# Altium project ECU.PrjPcb (part 2 of 2)

## Sheet CAN.SchDoc
size 420 x 297 mm; SheetNumber: 8; SheetTotal: 11
Used 2 times, as channels CAN 1, CAN 2. Parts and nets are listed once, with the designators drawn on the sheet.
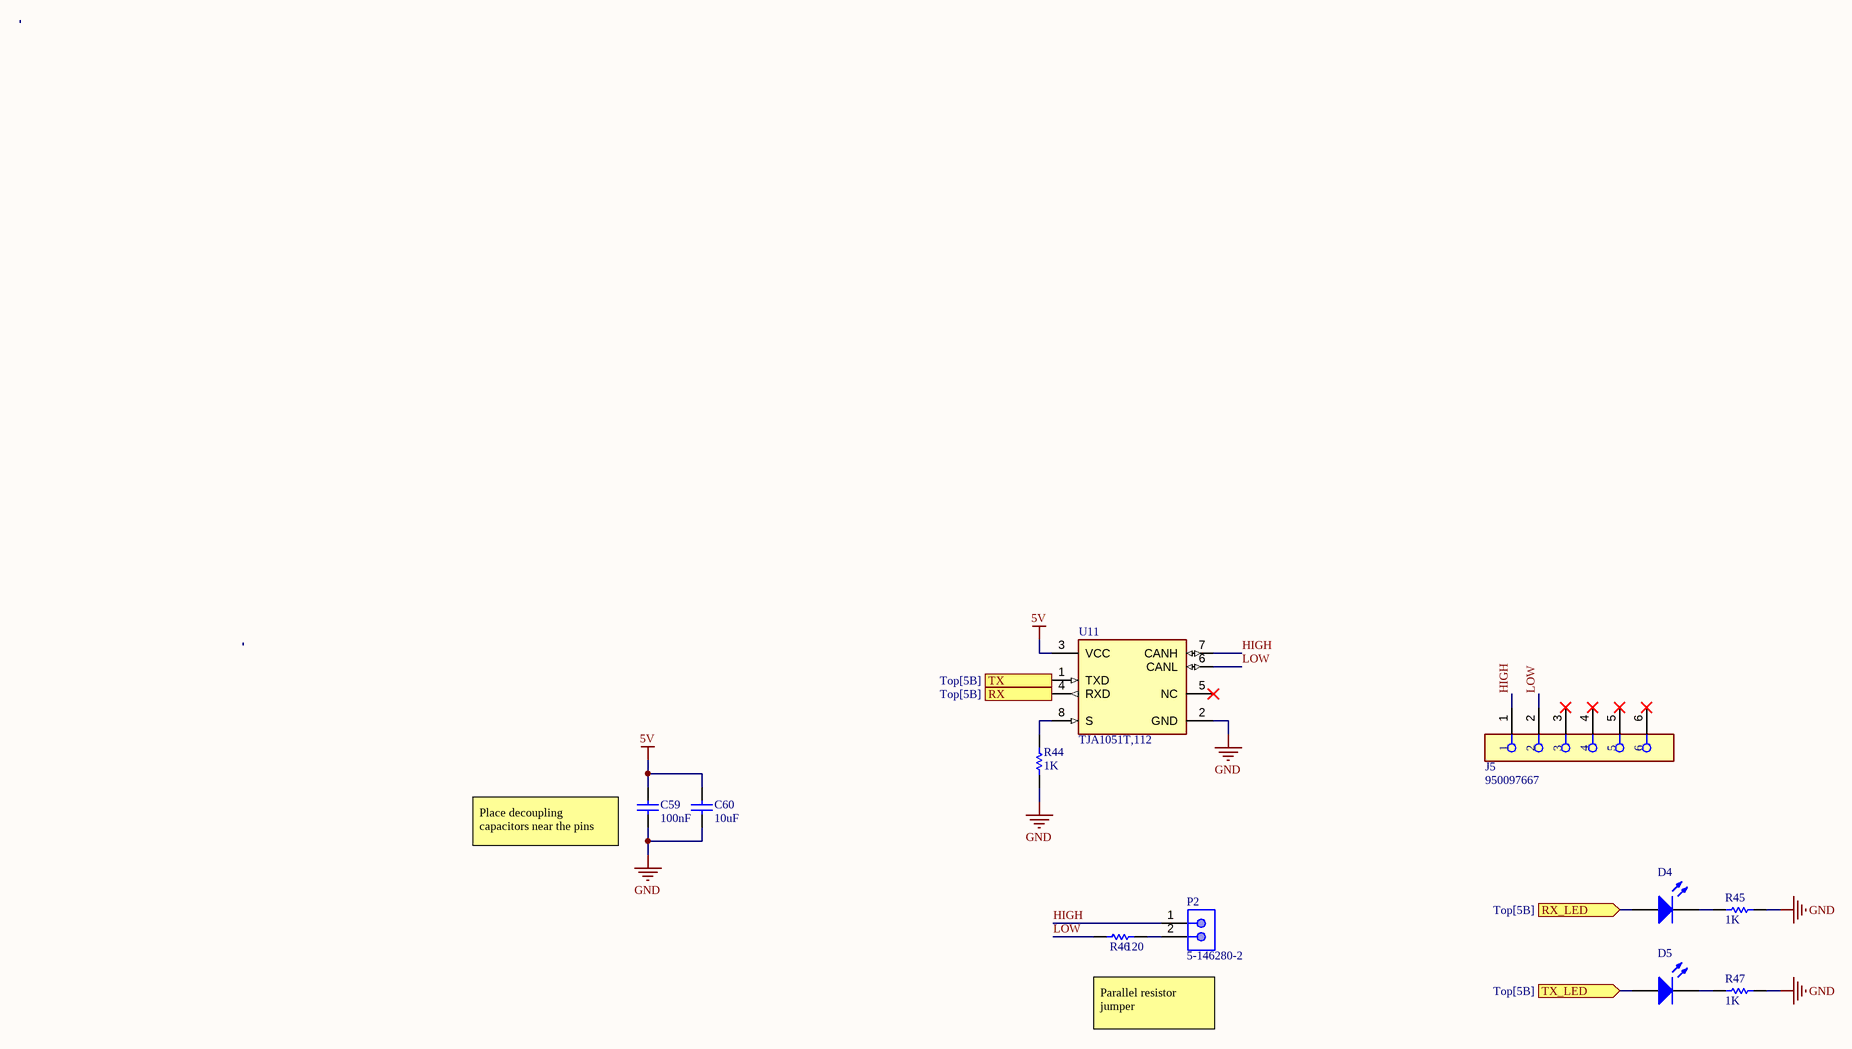
[diagram p8: CAN.SchDoc]

### Parts
C59  value 100nF  (hidden comment: Capacitor)
C60  value 10uF  (hidden comment: Capacitor)
D4  Light-Emitting Diode  (value not drawn)
D5  Light-Emitting Diode  (value not drawn)
J5  950097667  [FP-950097667-MFG]
P2  5-146280-2  [TECO-5-146280-2_V]
R44  value 1K  (hidden comment: Resistor)
R45  value 1K  (hidden comment: Resistor)
R46  value 120  (hidden comment: Resistor)
R47  value 1K  (hidden comment: Resistor)
U11  TJA1051T,112  [FP-SOT96-1-MFG]

### Ports
RX (out, see Top[5B]), RX_LED (in, see Top[5B]), TX (in, see Top[5B]), TX_LED (in, see Top[5B])

### Nets
5V: C59.2 C60.2 U11.3(VCC)
GND: C59.1 C60.1 R44.1 R45.2 R47.2 U11.2(GND)
HIGH: J5.1 P2.1 U11.7(CANH)
LOW: J5.2 R46.1 U11.6(CANL)
RX: U11.4(RXD) ; port RX
RX_LED: D4.1(A) ; port RX_LED
TX: U11.1(TXD) ; port TX
TX_LED: D5.1(A) ; port TX_LED
NetD4_2: D4.2(K) R45.1
NetD5_2: D5.2(K) R47.1
NetP2_2: P2.2 R46.2
NetR44_2: R44.2 U11.8(S)

Not connected (* = marked no-connect by the designer): J5 3* 4* 5* 6*; U11 5(NC)*

### Channels
CAN 1: designators end in _CAN_1; ports RX=NetU11_CAN_1_4 RX_LED=NetD4_CAN_1_1 TX=NetU11_CAN_1_1 TX_LED=NetD5_CAN_1_1
CAN 2: designators end in _CAN_2; ports RX=NetU11_CAN_2_4 RX_LED=NetD4_CAN_2_1 TX=NetU11_CAN_2_1 TX_LED=NetD5_CAN_2_1

### Notes on the sheet
- (near C59) Place decoupling capacitors near the pins
- Parallel resistor jumper
- THIS DOCUMENT AND THE DATA DISCLOSED HEREIN OR
- HEREWITH IS THE PROPERTY OF ALTIUM LIMITED AND MAY
- DWG NO:
- REVISION
- REV:
- DESCRIPTION
- DATE
- APPROVED
- BE FREELY DISTRIBUTED IN WHOLE. NO RIGHTS ARE
- RESERVED OR EXPRESS OR IMPLIED WARANTEE GIVEN.
- ENG:
- APPROVALS
- PROJECT
- DSN:
- CHK:
- REFERENCE DOCUMENTS
- PROJECT REVISION:
- TITLE
- DOCUMENT REVISION:
- DESIGN ITEM:
- BOM:
- FAB DWG:
- PCB DWG:
- ASSY DWG:
- SCALE:
- A3
- SIZE
- CAGE CODE
- FILE NAME
- DWG NO.
- SHEET
- OF
- REV

### Library data of the parts
C59 C60 = Capacitor: SimulationGenericComponent: True; Supplier 1: Arrow Electronics
D4 D5 = LED: AF: 1; BV: 0; BV_MAX: 1e99; EG: 1.11; FC: 0.5; IBV: 0.001; IS: 1e-14; MJSW: 0.33; NTUN: 30; TNOM: 27; XTI: 3; SimulationGenericComponent: True; CJO: 0; CJP: 0; CTA: 0; CTP: 0; FCS: 0.5; FV_MAX: 1e99; IKF: 0; IKR: 0; ISR: 1e-14; JSW: 0; JTUN: 0; JTUNSW: 0; KEG: 1; KF: 0; LEVEL: 1; N: 1; NBV: 1; NR: 1; NS: 1; PHP: 1; RS: 0; TCV: 0; TLEV: 0; TLEVC: 0; TM1: 0; TM2: 0; TPB: 0; TPHP: 0; TRS: 0; TRS2: 0; TT: 0; TTT1: 0; TTT2: 0; VJ: 1; XTITUN: 3
J5 = CMP-04778-000001-1: CONN MOD JACK 6P6C R/A UNSHLD; Manufacturer: Molex; Conn Gender: Female; Number Of Contacts: 6; Voltage Rating: 125V; Conn Orientation: Right Angle; Current Rating: 1.5A; Is Female: yes; Pitch: 1.27mm; Temperature Range Low: -40°C; Device Class L2: Modular / Ethernet Connectors; ComponentLink2URL: https://www.molex.com/webdocs/datasheets/pdf/en-us/0950097667_MODULAR_JACKS_PLUG.pdf; Temperature Range High: +80°C; Contact Material: Gold,Nickel; Automotive: No; Digikey Description: CONN MOD JACK 6P6C R/A UNSHLD; Octopart: https://octopart.com/95009-7667-molex-24622630; Device Class L1: Connectors; RoHS: TRUE; Category: Conn; Package: 950097667; Manufacturer Part Number: 950097667; ComponentLink2Description: Datasheet; Device Class L3: unset; Mouser Description: Modular Connectors / Ethernet Connectors STD JACK RA 6/6 NO RIB; Height: 16.25mm; Footprint Url: https://www.molex.com/pdm_docs/sd/950097667_sd.pdf; Temperature: -40°C to +80°C; Lead Free: Yes
P2 = CMP-2000-07492-1: Male Header, Pitch 2.54 mm, 1 x 2 Position, Height 8.21 mm, Tail Length 3.05 mm, -65 to 105 degC, RoHS, Bulk; Manufacturer: TE Connectivity; Mating Connector Lock: No(Without); Number of Positions: 2; Pitch: 2.54mm; PCB Mounting Orientation: Vertical; Keyed: No; Case\/Package: 100; Mating Post Length: 0.23inch; High Temperature Housing: Yes; Max Current Rating: 5A; PCB Thickness: 0.063inch; PCB Mount Retention: Without; Approvals: CSA; Current Rating: 3A; Radiation Hardening: No; Length: 4.67mm; Contact Mating Length: 0.23inch; Connector Type: Header; Number of Rows: 1; Termination Post Length: 0.12inch; Board Standoff: No(Without); Max Operating Temperature: 105degC; Contact Shape: Square; Selectively Loaded: No(Without); Gasket: No(Without); Number of Contacts: 2; Contact Gender: Male; Mating Alignment: No(Without); Manufacturer URL: http://www.te.com/; Datasheet URL: http://www.te.com/commerce/DocumentDelivery/DDEController?Action=showdoc&DocId=Customer+Drawing%7F146280%7FH1%7Fpdf%7FEnglish%7FENG_CD_146280_H1.pdf%7F5-146280-2; Mount: ThroughHole; Orientation: Straight; Packaging: Carton; Package Reference: 5-146280-2; Package Quantity: 500; Stabilizers: No(Without); Row Spacing: 2.54mm; Contact Material: CopperAlloy; Panel Mount Retention: No(Without); Datasheet Version: Rev. H1, 08/2016; Housing Colour: Black; Colour: Black; Package Description: Male Header, Pitch 2.54 mm, 1 x 2 Position, Height 8.21 mm, Tail Length 3.05 mm; Contact Plating: Matte; Housing Material: Polymer; Contact Protection: No(Without); Min Operating Temperature: -65degC; Mounting Technology: ThroughHole; Flammability Rating: UL94V-0; RoHSCompliant: true; Termination: ThroughHole; Depth: 2.34mm; High Speed Serial Data Connector: No
R44-R47 = Resistor: TC1: 0; SimulationGenericComponent: True; TC2: 0
U11 = CMP-10098-000004-1: IC TRANSCEIVER HALF 1/1 8SO; Manufacturer: NXP Semiconductors; Max Supply Voltage: 5.5V; Interface: CAN; Automotive Grade: Grade 0; Nominal Supply Current: 1-80mA; Max Junction Temp: +150°C; Standoff Height: 0.1mm; Min Supply Voltage: 4.5V; Lead Free: Yes; ComponentLink2URL: https://www.nxp.com/docs/en/data-sheet/TJA1051.pdf; Temperature Range High: +150°C; RoHS: TRUE; Package: SOT96-1; Digikey Description: IC TRANSCEIVER HALF 1/1 8SO; Device Class L3: unset; Device Class L2: Interface ICs; Manufacturer Part Number: TJA1051T,112; Device Class L1: Integrated Circuits (ICs); Automotive: Yes; Temperature: -40°C to +150°C; Octopart: https://octopart.com/tja1051t%2C112-nxp+semiconductors-11542082; Category: IC; Mouser Description: TJA1051 Series 5.5 V 1 Mbit/s Surface Mount High-Speed CAN Transceiver - SOIC-8; ComponentLink2Description: Datasheet; Footprint Url: https://www.nxp.com/docs/en/package-information/SOT96-1.pdf; Height: 1.75mm; Temperature Range Low: -40°C

## Sheet Motion.SchDoc
size 420 x 297 mm; SheetNumber: 5; SheetTotal: 11
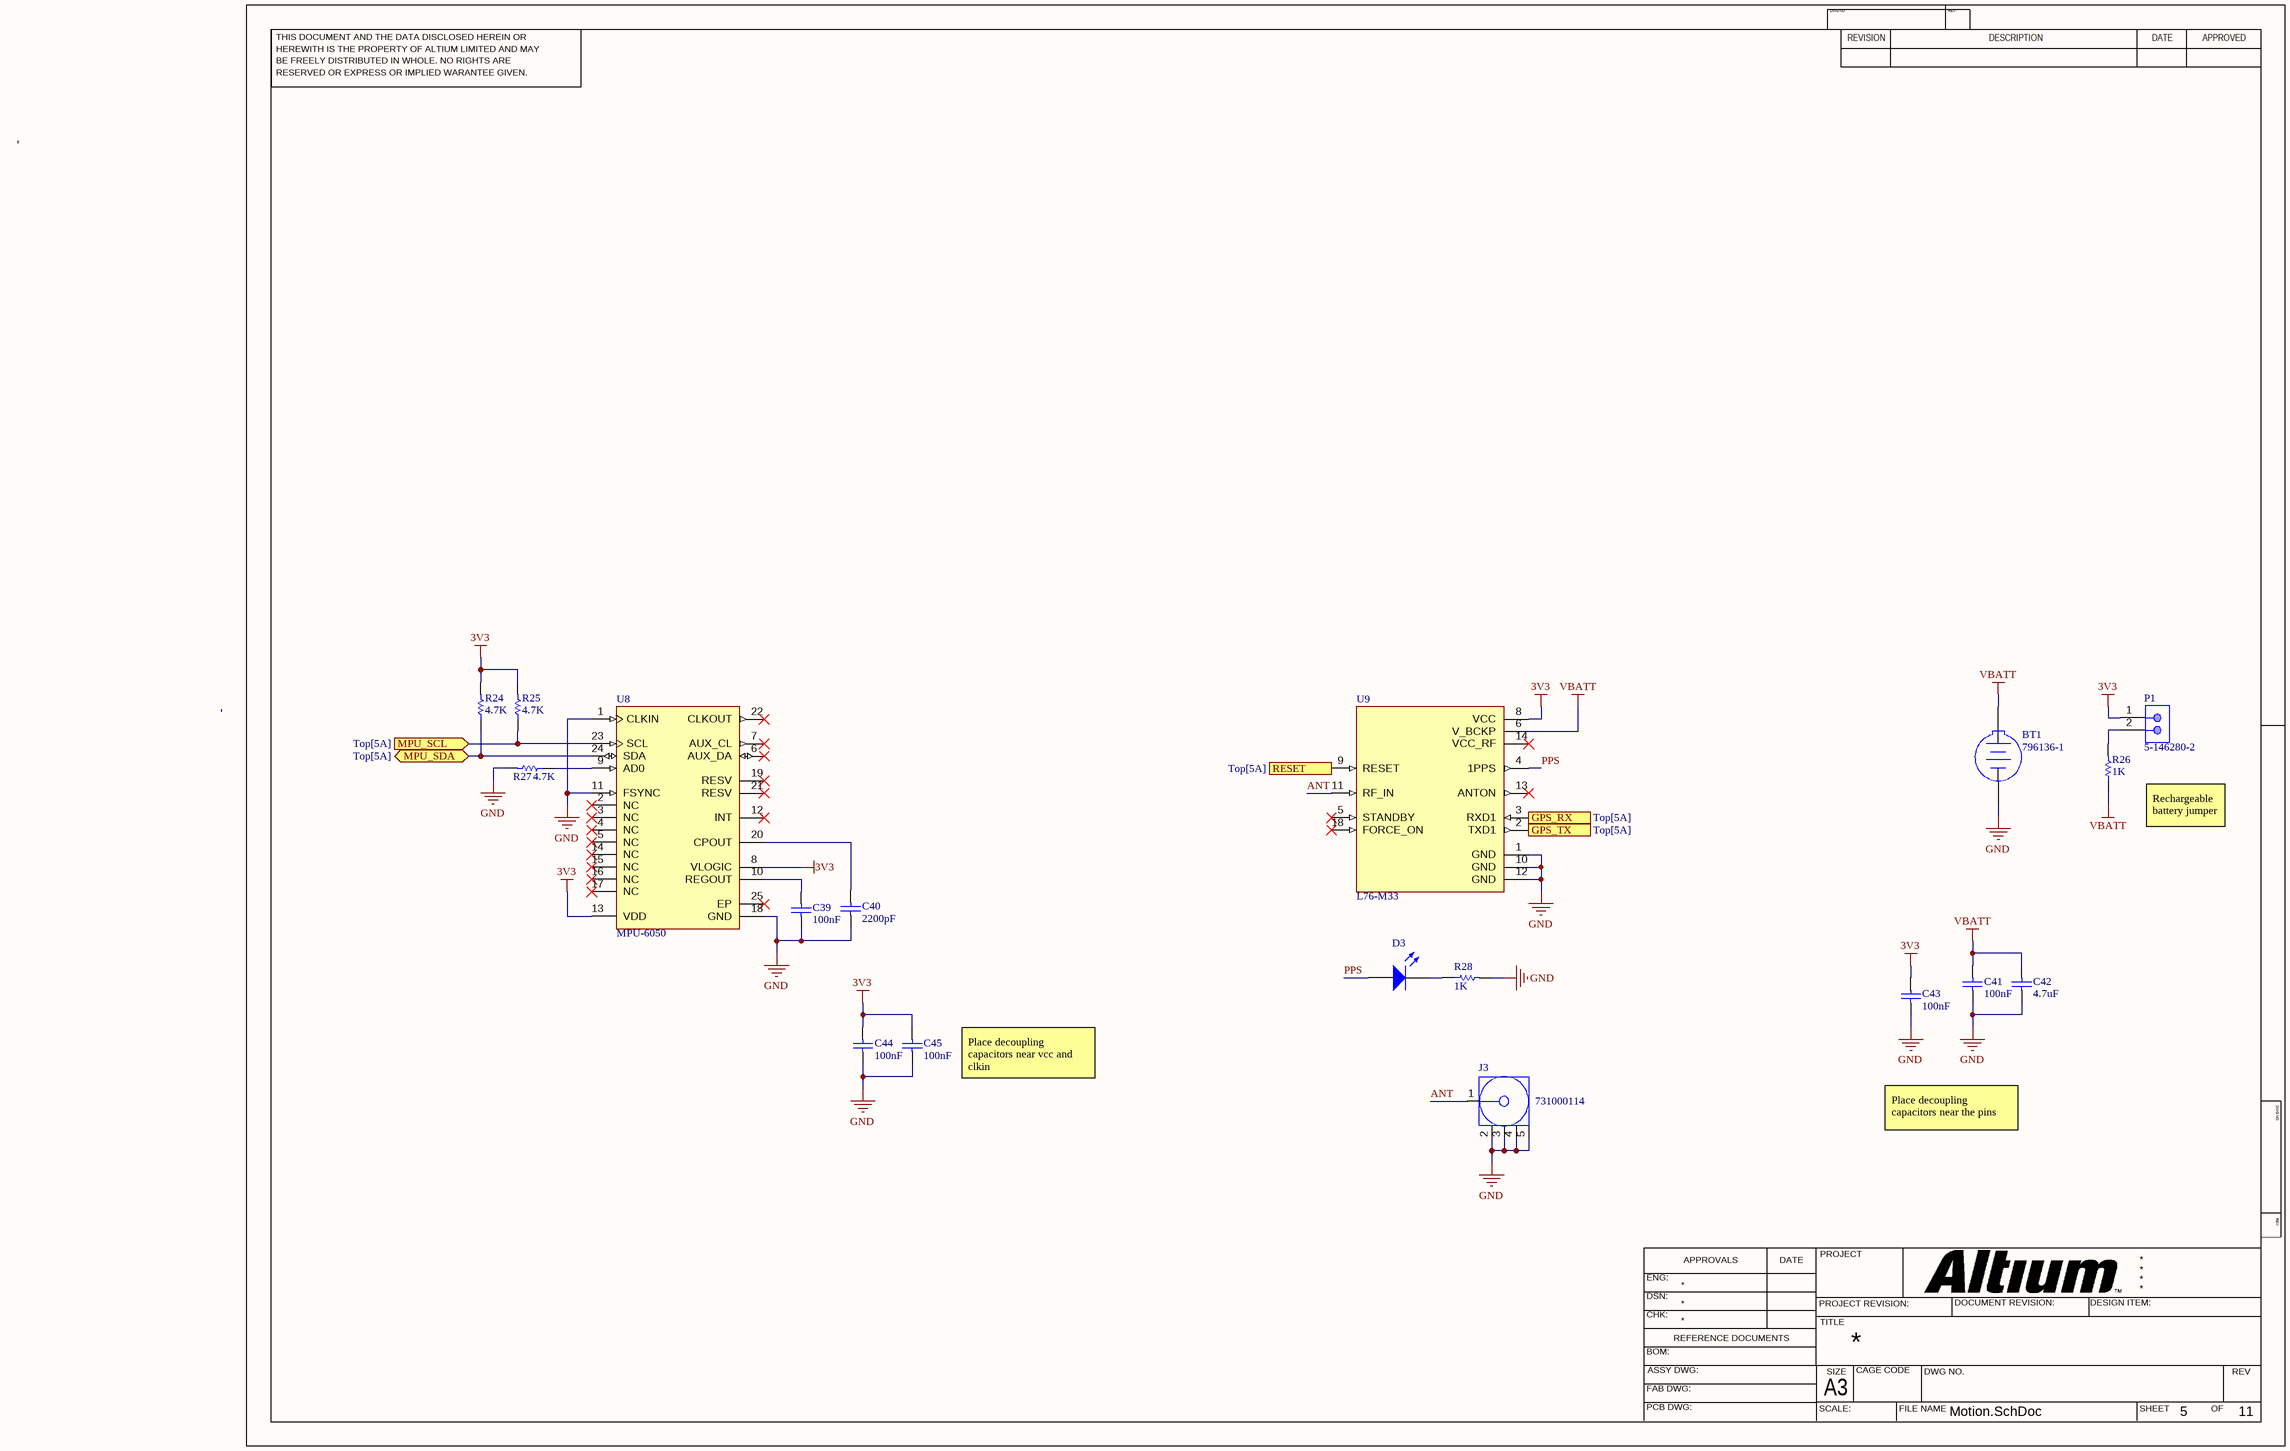
[diagram p9: Motion.SchDoc]

### Parts
BT1  796136-1  [TECO-796136-1_V]
C39  value 100nF  (hidden comment: Capacitor)
C40  value 2200pF  (hidden comment: Capacitor)
C41  value 100nF  (hidden comment: Capacitor)
C42  value 4.7uF  (hidden comment: Capacitor)
C43  value 100nF  (hidden comment: Capacitor)
C44  value 100nF  (hidden comment: Capacitor)
C45  value 100nF  (hidden comment: Capacitor)
D3  Light-Emitting Diode  (value not drawn)
J3  731000114  [MOLX-731000114_V]
P1  5-146280-2  [TECO-5-146280-2_V]
R24  value 4.7K  (hidden comment: Resistor)
R25  value 4.7K  (hidden comment: Resistor)
R26  value 1K  (hidden comment: Resistor)
R27  value 4.7K  (hidden comment: Resistor)
R28  value 1K  (hidden comment: Resistor)
U8  MPU-6050  [IS-QFN-24_V]
U9  L76-M33  [XCVR_L76-M33]

### Ports
GPS_RX (in, see Top[5A]), GPS_TX (out, see Top[5A]), MPU_SCL (in, see Top[5A]), MPU_SDA (bidir, see Top[5A]), RESET (in, see Top[5A])

### Nets
3V3: C43.2 C44.2 C45.2 P1.1 R24.2 R25.2 U8.8(VLOGIC) U8.13(VDD) U9.8(VCC)  [project net RDCT]
GND: BT1.2(-) C39.1 C40.1 C41.1 C42.1 C43.1 C44.1 C45.1 J3.2 J3.3 J3.4 J3.5 R27.2 R28.2 U8.1(CLKIN) U8.11(FSYNC) U8.18(GND) U9.1(GND) U9.10(GND) U9.12(GND)
VBATT: BT1.1(+) C41.2 C42.2 R26.1 U9.6(V_BCKP)
ANT: J3.1 U9.11(RF_IN)
PPS: D3.1(A) U9.4(1PPS)
NetC39_2: C39.2 U8.10(REGOUT)
NetC40_2: C40.2 U8.20(CPOUT)
NetD3_2: D3.2(K) R28.1
NetP1_2: P1.2 R26.2
NetR24_1: R24.1 U8.24(SDA) ; port MPU_SDA
NetR25_1: R25.1 U8.23(SCL) ; port MPU_SCL
NetR27_1: R27.1 U8.9(AD0)
NetU9_2: U9.2(TXD1) ; port GPS_TX
NetU9_3: U9.3(RXD1) ; port GPS_RX
NetU9_9: U9.9(RESET) ; port RESET

Not connected (* = marked no-connect by the designer): U8 2(NC)* 3(NC)* 4(NC)* 5(NC)* 6(AUX_DA)* 7(AUX_CL)* 12(INT)* 14(NC)* 15(NC)* 16(NC)* 17(NC)* 19(RESV)* 21(RESV)* 22(CLKOUT)* 25(EP)*; U9 5(STANDBY)* 13(ANTON)* 14(VCC_RF)* 18(FORCE_ON)*

### Notes on the sheet
- Rechargeable battery jumper
- Place decoupling capacitors near vcc and clkin
- Place decoupling capacitors near the pins
- THIS DOCUMENT AND THE DATA DISCLOSED HEREIN OR
- HEREWITH IS THE PROPERTY OF ALTIUM LIMITED AND MAY
- DWG NO:
- REVISION
- REV:
- DESCRIPTION
- DATE
- APPROVED
- BE FREELY DISTRIBUTED IN WHOLE. NO RIGHTS ARE
- RESERVED OR EXPRESS OR IMPLIED WARANTEE GIVEN.
- ENG:
- APPROVALS
- PROJECT
- DSN:
- CHK:
- REFERENCE DOCUMENTS
- PROJECT REVISION:
- TITLE
- DOCUMENT REVISION:
- DESIGN ITEM:
- BOM:
- FAB DWG:
- PCB DWG:
- ASSY DWG:
- SCALE:
- A3
- SIZE
- CAGE CODE
- FILE NAME
- DWG NO.
- SHEET
- OF
- REV

### Library data of the parts
BT1 = CMP-1684-00006-2: Battery Connector, 1 Cell, CR2032, 2-Pin SMD, RoHS, Tape and Reel; Case\Package: 0603; Lens Style: Diffused; Illumination Colour: Blue; Nominal Vf: 3.3 V; Luminous Intensity: 28 mcd; Forward Voltage: 2.8 V; Forward Current: 20 mA; Viewing Angle: 130 degrees; Pins: 2; Package Quantity: 3000; Case Code (Imperial): 0603; Colour: Blue; ComponentLink2Description: Datasheet; Packaging: Tape and Reel; Length: 1.6 mm; Max Operating Temperature: 80 degC; ComponentLink2URL: http://www.te.com/commerce/DocumentDelivery/DDEController?Action=srchrtrv&DocNm=796136&DocType=Customer+Drawing&DocLang=English&DocFormat=pdf&PartCntxt=796136-1; PackageReference: 796136-1; Case Code (Metric): 1608; PackageDescription: 2-Pin Surface Mount Device, Body 32.31 x 19.05 mm; ComponentLink1Description: Manufacturer URL; Mount: Surface Mount; ComponentLink1URL: http://www.te.com/; Min Operating Temperature: -20 degC; Width: 0.8 mm; DatasheetVersion: Dec-13; Radiation Hardening: No; RoHSCompliant: true; Height: 0.8 mm
C39-C45 = Capacitor: SimulationGenericComponent: True; Supplier 1: Arrow Electronics
D3 = LED: as D4 on sheet CAN; CJO: 0; CJP: 0; CTA: 0; CTP: 0; FCS: 0.5; FV_MAX: 1e99; IKF: 0; IKR: 0; ISR: 1e-14; JSW: 0; JTUN: 0; JTUNSW: 0; KEG: 1; KF: 0; LEVEL: 1; N: 1; NBV: 1; NR: 1; NS: 1; PHP: 1; RS: 0; TCV: 0; TLEV: 0; TLEVC: 0; TM1: 0; TM2: 0; TPB: 0; TPHP: 0; TRS: 0; TRS2: 0; TT: 0; TTT1: 0; TTT2: 0; VJ: 1; XTITUN: 3
J3 = CMP-2000-05487-1: SMA Right-Angle PCB Jack Receptacle, Brass Body, Gold Plated, 50 Ohm, 5-Pin THD, RoHS, Tray; Manufacturer: Molex; Datasheet Version: 09/2016; Package Description: 5-Pin Through Hole Device, Body 14.8 x 6.35 mm, Pitch 2.54 mm; Datasheet URL: http://www.molex.com/webdocs/datasheets/pdf/en-us/0731000114_RF_COAX_CONNECTORS.pdf; Manufacturer URL: http://www.molex.com/; Package Reference: 731000114; Mounting Technology: ThroughHole; Package URL: http://www.molex.com/pdm_docs/sd/731000114_sd.pdf
P1 = CMP-2000-07492-1: as P2 on sheet CAN; Radiation Hardening: No; Length: 4.67mm; Contact Mating Length: 0.23inch; Connector Type: Header; Number of Rows: 1; Termination Post Length: 0.12inch; Board Standoff: No(Without); Max Operating Temperature: 105degC; Contact Shape: Square; Selectively Loaded: No(Without); Gasket: No(Without); Number of Contacts: 2; Contact Gender: Male; Mating Alignment: No(Without); Manufacturer URL: http://www.te.com/; Datasheet URL: http://www.te.com/commerce/DocumentDelivery/DDEController?Action=showdoc&DocId=Customer+Drawing%7F146280%7FH1%7Fpdf%7FEnglish%7FENG_CD_146280_H1.pdf%7F5-146280-2; Mount: ThroughHole; Orientation: Straight; Packaging: Carton; Package Reference: 5-146280-2; Package Quantity: 500; Stabilizers: No(Without); Row Spacing: 2.54mm; Contact Material: CopperAlloy; Panel Mount Retention: No(Without); Datasheet Version: Rev. H1, 08/2016; Housing Colour: Black; Colour: Black; Package Description: Male Header, Pitch 2.54 mm, 1 x 2 Position, Height 8.21 mm, Tail Length 3.05 mm; Contact Plating: Matte; Housing Material: Polymer; Contact Protection: No(Without); Min Operating Temperature: -65degC; Mounting Technology: ThroughHole; Flammability Rating: UL94V-0; RoHSCompliant: true; Termination: ThroughHole; Depth: 2.34mm; High Speed Serial Data Connector: No
R24-R28 = Resistor: TC1: 0; SimulationGenericComponent: True; TC2: 0
U8 = CMP-1753-00002-2: 3-Axis Gyroscope, Accelerometer and a Digital Motion Processor(TM) (DMP), 2.375 to 3.46 V, -40 to 85 degC, 24-Pin QFN, RoHS, Tape and Reel; Manufacturer: InvenSense; Featured Product: MPU-60506-Axis,IntegratedI²CSolution; Other Names: 1428-1007-2 / MPU6050; Sensor Type: MotionTracking; Online Catalog: MPU-6000™Series; Unit PriceUSD: Digital; Datasheet Version: Rev. 3.3, 05/2012; Category: Sensors,Transducers; Datasheet URL: http://datasheet.octopart.com/MPU-6050-InvenSense-datasheet-14421344.pdf; Family: Multifunction; Standard Package: 5,000; Manufacturer URL: http://www.invensense.com/; Output Type: Digital; Dynamic Catalog: MPU-6000™Series
U9 = CMP-009-000000-1: L76, the extremely compact GNSS module, is a concurrent GNSS receiver with multiple GNSS systems. It provides simultaneous GPS, GLONASS, BeiDou, Galileo and QZSS open service L1 reception capability.; MF: Quectel; Design Item ID: L76-M33; Value: *; MP: L76-M33; Component Type: Standard; Price: None; Availability: Unavailable; SnapEDA_Link: https://www.snapeda.com/parts/L76-M33/Quectel/view-part/235665/?ref=snap; Pin Count: 14; Package: None; Source: SnapEDAsch.SchLib

## Sheet Serial.SchDoc
size 420 x 297 mm; SheetNumber: 7; SheetTotal: 11
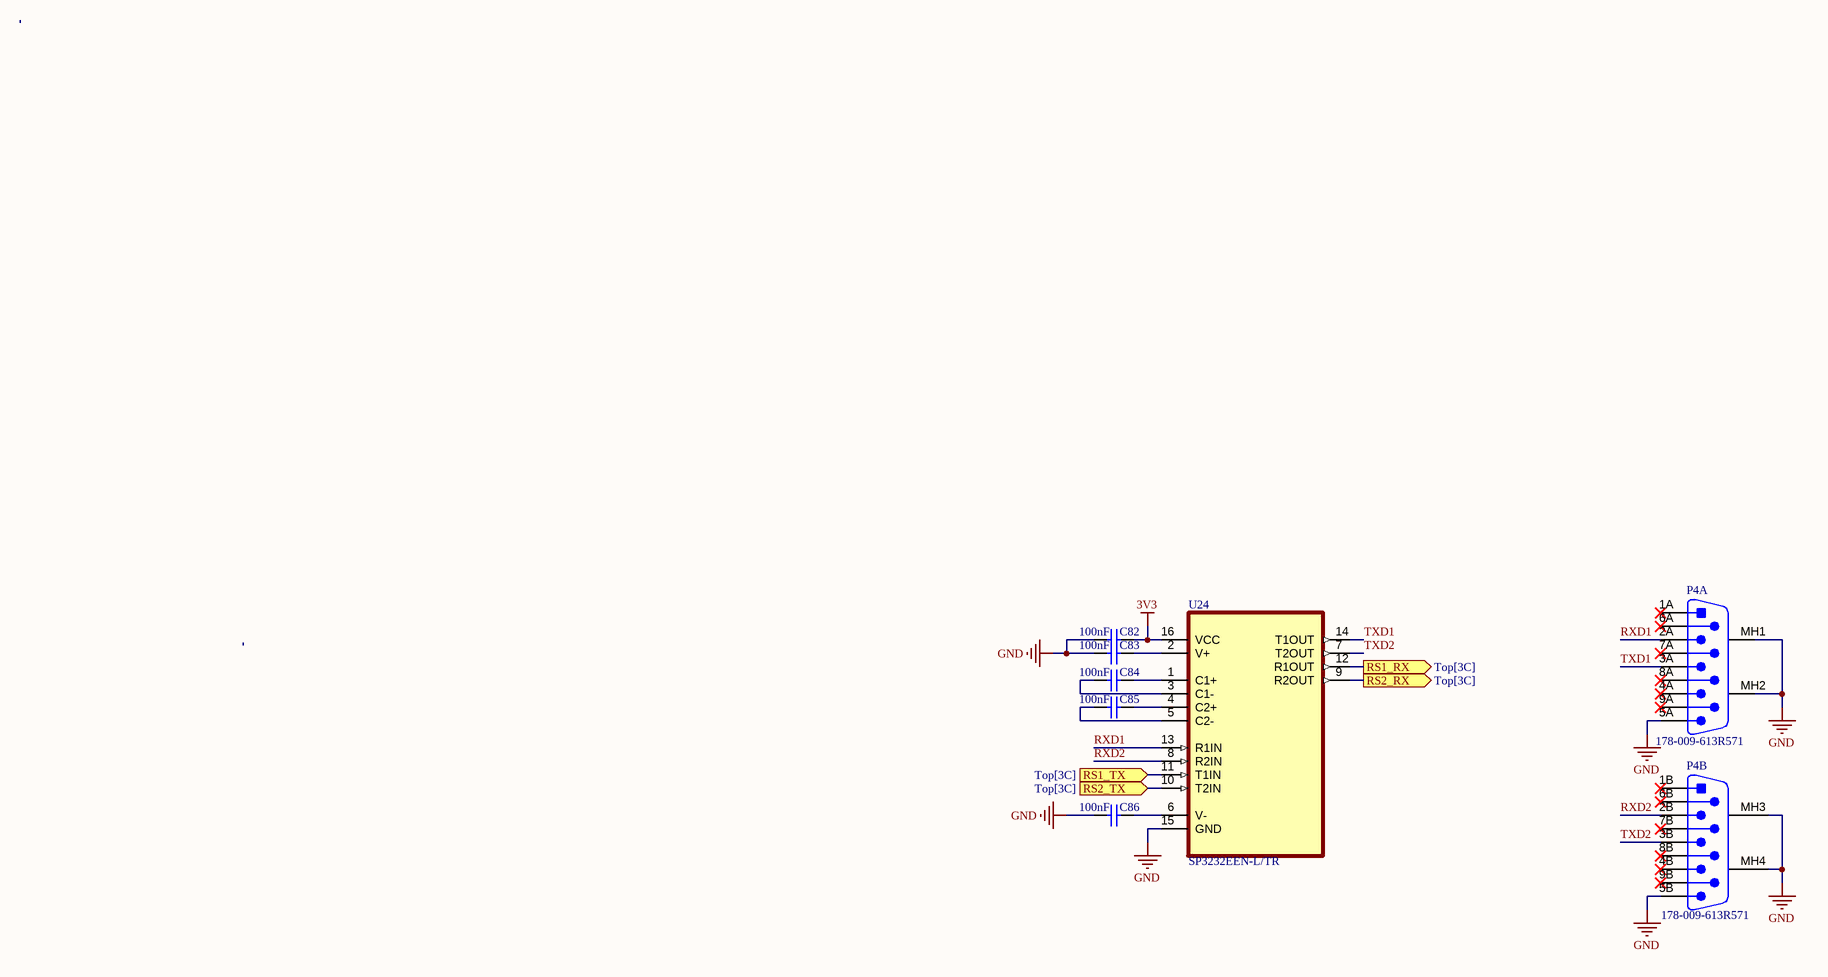
[diagram p10: Serial.SchDoc]

### Parts
C82  value 100nF  (hidden comment: Capacitor)
C83  value 100nF  (hidden comment: Capacitor)
C84  value 100nF  (hidden comment: Capacitor)
C85  value 100nF  (hidden comment: Capacitor)
C86  value 100nF  (hidden comment: Capacitor)
P4  178-009-613R571  [NORCO-178-009-613R571_V]  (parts A,B of 2)
U24  SP3232EEN-L/TR  [SOIC127P600X175-16N]

### Ports
RS1_RX (out, see Top[3C]), RS1_TX (in, see Top[3C]), RS2_RX (out, see Top[3C]), RS2_TX (in, see Top[3C])

### Nets
3V3: C82.1 U24.16(VCC)  [project net RDCT]
GND: C82.2 C83.2 C86.2 P4.5A(4A) P4.5B P4.MH1 P4.MH2 P4.MH3 P4.MH4 U24.15(GND)
RXD1: P4.2A U24.13(R1IN)
RXD2: P4.2B U24.8(R2IN)
TXD1: P4.3A(6A) U24.14(T1OUT)
TXD2: P4.3B U24.7(T2OUT)
NetC83_1: C83.1 U24.2(V+)
NetC84_1: C84.1 U24.1(C1+)
NetC84_2: C84.2 U24.3(C1-)
NetC85_1: C85.1 U24.4(C2+)
NetC85_2: C85.2 U24.5(C2-)
NetC86_1: C86.1 U24.6(V-)
NetU24_9: U24.9(R2OUT) ; port RS2_RX
NetU24_10: U24.10(T2IN) ; port RS2_TX
NetU24_11: U24.11(T1IN) ; port RS1_TX
NetU24_12: U24.12(R1OUT) ; port RS1_RX

Not connected (* = marked no-connect by the designer): P4 1A* 1B* 4A(5A)* 4B* 6A(3A)* 6B* 7A* 7B* 8A* 8B* 9A* 9B*

### Notes on the sheet
- THIS DOCUMENT AND THE DATA DISCLOSED HEREIN OR
- HEREWITH IS THE PROPERTY OF ALTIUM LIMITED AND MAY
- DWG NO:
- REVISION
- REV:
- DESCRIPTION
- DATE
- APPROVED
- BE FREELY DISTRIBUTED IN WHOLE. NO RIGHTS ARE
- RESERVED OR EXPRESS OR IMPLIED WARANTEE GIVEN.
- ENG:
- APPROVALS
- PROJECT
- DSN:
- CHK:
- REFERENCE DOCUMENTS
- PROJECT REVISION:
- TITLE
- DOCUMENT REVISION:
- DESIGN ITEM:
- BOM:
- FAB DWG:
- PCB DWG:
- ASSY DWG:
- SCALE:
- A3
- SIZE
- CAGE CODE
- FILE NAME
- DWG NO.
- SHEET
- OF
- REV

### Library data of the parts
C82-C86 = Capacitor: SimulationGenericComponent: True; Supplier 1: Arrow Electronics
P4 = CMP-2000-05502-1: D-Sub Connector, Stacked Plug, RA, -55 to 105 degC, 18-Pin THD, RoHS, Tray; Manufacturer: Norcomp; Product Training Modules: D-SubConnectors; 3D Model: 178-009-613Rzz1.pdf178-009-613Rzz1.stp178-009-613Rzz1.igs; Number of Positions: 9,9; Catalog Drawings: 178,179,189SeriesFront; Flange Feature: MatingSide,FemaleScrewlock(4-40); Connector Style: D-Sub-Stacked; Connector Type: Plug,MalePins; Associated Product: 160-09MA-ND-DUSTCOVERFORDB9MALE; Other Related Documents: 178-009-613R571MaterialDeclaration; Current Rating: 5A; Other Names: 1109MME178009613R571; Online Catalog: 178Series; Family: D-SubConnectors; Ingress Protection: -; Package Reference: 178-009-613R571; Features: BoardLock,GroundingIndents,Shielded; Packaging: Tray; Voltage Rating: -; Standard Package: 45; Number of Rows: 2,2; Termination: Solder; Contact Type: Signal; Series: 178; Operating Temperature: -55°C~105°C; Contact Finish: Gold; Color: Black; Shell Material, Finish: Steel,NickelPlated; Category: Connectors,Interconnects; Datasheet URL: http://www.norcomp.net/rohspdfs/Connectors/17Y/178/613/178-YYY-613R571.pdf; Mounting Type: BoardEdge,ThroughHole,RightAngle; Datasheet Version: Rev. 6, 03/2007; Manufacturer URL: http://www.norcomp.net/; Contact Finish Thickness: Flash; Package Description: 18-Pin Through Hole Device, Body 30.58 x 19.61 mm; Housing Material: Polyamide(PA9T),Nylon9T; Shell Size, Connector Layout: 1(DE,E);1(DE,E); Mounting Technology: ThroughHole
U24 = CMP-017-000000-1: 2/2 Transceiver Full RS232 16-SOIC; MF: MaxLinear, Inc.; Design Item ID: SP3232EEN-L/TR; Price: None; Component Type: Standard; Availability: Unavailable; Source: SnapEDAsch.SchLib; MP: SP3232EEN-L/TR; Value: *; Pin Count: 16; SnapEDA_Link: https://www.snapeda.com/parts/SP3232EEN-L/TR/MaxLinear,%20Inc./view-part/552440/?ref=snap; Package: SOIC-16 Exar

## Nets that join several sheets
5V: Power (12 pins), Relays (C70.1 U12.5), CAN 1 (C59_CAN_1.2 C60_CAN_1.2 U11_CAN_1.3), CAN 2 (C59_CAN_2.2 C60_CAN_2.2 U11_CAN_2.3)
12V: Power (7 pins), Relays (27 pins)
GND: Power (25 pins), MCU (38 pins), Relays (56 pins), Acceleration (C80.1 R106.2 U22.4), Inputs (5 pins), Ethernet (22 pins), SD (7 pins), CAN 1 (6 pins), Motion (20 pins), Serial (10 pins), CAN 2 (6 pins)
RDCT: Power (13 pins), MCU (R4.2 R5.2 SW1.1), Acceleration (C80.2), Inputs (6 pins), Ethernet (9 pins), SD (8 pins), Motion (9 pins), Serial (C82.1 U24.16)